# Altium schematic sheet Ethernet2_MDIO.SchDoc
size A4; DocumentNumber: 18; SheetNumber: 18; SheetTotal: 47
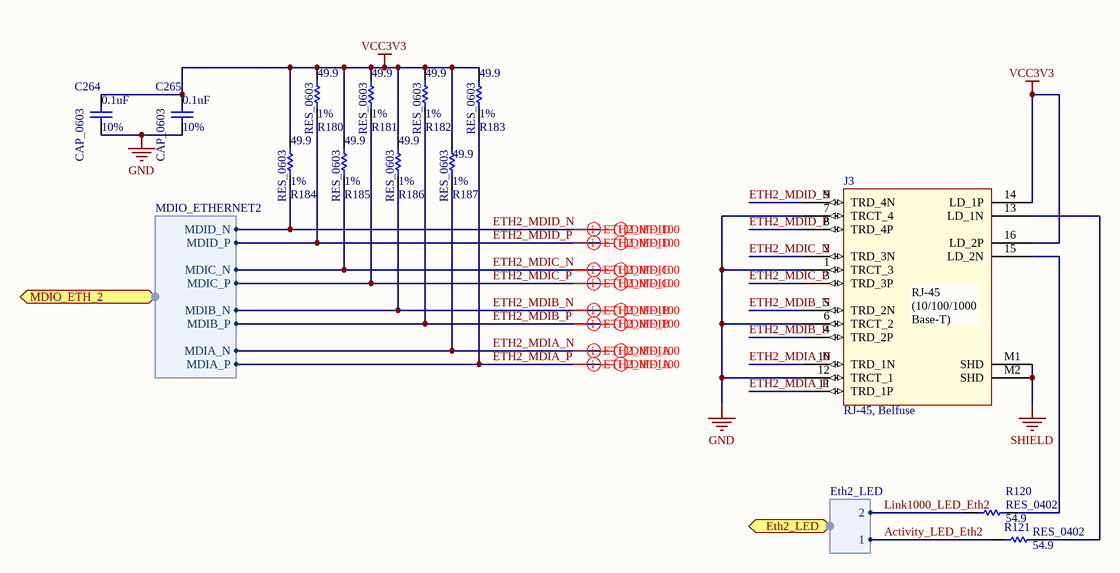
[diagram p0: Ethernet2_MDIO.SchDoc]

## Parts
C264  CAP_0603  value 0.1uF  Tolerance: 10%  [CAPC0603(1608)100_N]
C265  CAP_0603  value 0.1uF  Tolerance: 10%  [CAPC0603(1608)100_N]
J3  RJ-45, Belfuse  [RJ-45_BelFuse_L834-1G1T-S7_pcb]
R120  RES_0402  value 54.9  [RESC0402(1005)_N]
R121  RES_0402  value 54.9  [RESC0402(1005)_N]
R180  RES_0603  value 49.9  Tolerance: 1%  [RESC0603(1608)_N]
R181  RES_0603  value 49.9  Tolerance: 1%  [RESC0603(1608)_N]
R182  RES_0603  value 49.9  Tolerance: 1%  [RESC0603(1608)_N]
R183  RES_0603  value 49.9  Tolerance: 1%  [RESC0603(1608)_N]
R184  RES_0603  value 49.9  Tolerance: 1%  [RESC0603(1608)_N]
R185  RES_0603  value 49.9  Tolerance: 1%  [RESC0603(1608)_N]
R186  RES_0603  value 49.9  Tolerance: 1%  [RESC0603(1608)_N]
R187  RES_0603  value 49.9  Tolerance: 1%  [RESC0603(1608)_N]

## Ports
Eth2_LED (harness Eth2_LED), MDIO_ETH_2 (harness MDIO_ETHERNET2)

## Harnesses
MDIO_ETHERNET2: MDIA_P, MDIA_N, MDIB_P, MDIB_N, MDIC_P, MDIC_N, MDID_P, MDID_N
Eth2_LED: 1, 2

## Nets
GND: C264.1 C265.1 J3.1(TRCT_3) J3.6(TRCT_2) J3.7(TRCT_4) J3.12(TRCT_1)
SHIELD: J3.M1(SHD) J3.M2(SHD)
VCC3V3: C264.2 C265.2 J3.14(LD_1P) J3.16(LD_2P) R180.2 R181.2 R182.2 R183.2 R184.2 R185.2 R186.2 R187.2
Activity_LED_Eth2: R121.2 ; port Eth2_LED.1
ETH2_MDIA_N: J3.10(TRD_1N) R187.1 ; port MDIO_ETH_2.MDIA_N
ETH2_MDIA_P: J3.11(TRD_1P) R183.1 ; port MDIO_ETH_2.MDIA_P
ETH2_MDIB_N: J3.5(TRD_2N) R186.1 ; port MDIO_ETH_2.MDIB_N
ETH2_MDIB_P: J3.4(TRD_2P) R182.1 ; port MDIO_ETH_2.MDIB_P
ETH2_MDIC_N: J3.2(TRD_3N) R185.1 ; port MDIO_ETH_2.MDIC_N
ETH2_MDIC_P: J3.3(TRD_3P) R181.1 ; port MDIO_ETH_2.MDIC_P
ETH2_MDID_N: J3.9(TRD_4N) R184.1 ; port MDIO_ETH_2.MDID_N
ETH2_MDID_P: J3.8(TRD_4P) R180.1 ; port MDIO_ETH_2.MDID_P
Link1000_LED_Eth2: R120.2 ; port Eth2_LED.2
NetJ3_13: J3.13(LD_1N) R121.1
NetJ3_15: J3.15(LD_2N) R120.1

## Layout directives
differential pair: ETH2_MDIA_N, ETH2_MDIA_P, ETH2_MDIB_N, ETH2_MDIB_P, ETH2_MDIC_N, ETH2_MDIC_P, ETH2_MDID_N, ETH2_MDID_P
mark named DIFF_100: ETH2_MDIA_N, ETH2_MDIA_P, ETH2_MDIB_N, ETH2_MDIB_P, ETH2_MDIC_N, ETH2_MDIC_P, ETH2_MDID_N, ETH2_MDID_P

## Notes on the sheet
- (in symbol L834-1G1T-S7) RJ-45 / (10/100/1000 Base-T)

## Library data of the parts
C264 C265 = C0603C104K5RACTU: CAP CER 0.1UF 50V 10% X7R 0603; Manufacturer: Kemet; Part Number: C0603C104K5RACTU; Footprint Ref: CAPC0603(1608)100_N; Library Ref: CAP_0603
J3 = L834-1G1T-S7: RJ-45, Belfuse, Gigabit Magnetic Jack; Part Number: L834-1G1T-S7; Manufacturer: Belfuse
R120 R121 = ERJ-2RKF54R9X: RES 54.9 OHM 1/10W 1% 0402 SMD; Manufacturer: Panasonic Electronic Components; Tolerance: *; Part Number: ERJ-2RKF54R9X; Footprint Ref: RESC0402(1005)_N; Library Ref: RES_0402
R180-R187 = ERJ-3EKF49R9V: RES 49.9 OHM 1/10W 1% 0603 SMD; Manufacturer: Panasonic Electronics Components; Part Number: ERJ-3EKF49R9V; Footprint Ref: RESC0603(1608)_N; Library Ref: RES_0603